# Altium schematic sheet [16]-ETH_SWITCH.SchDoc
size A4
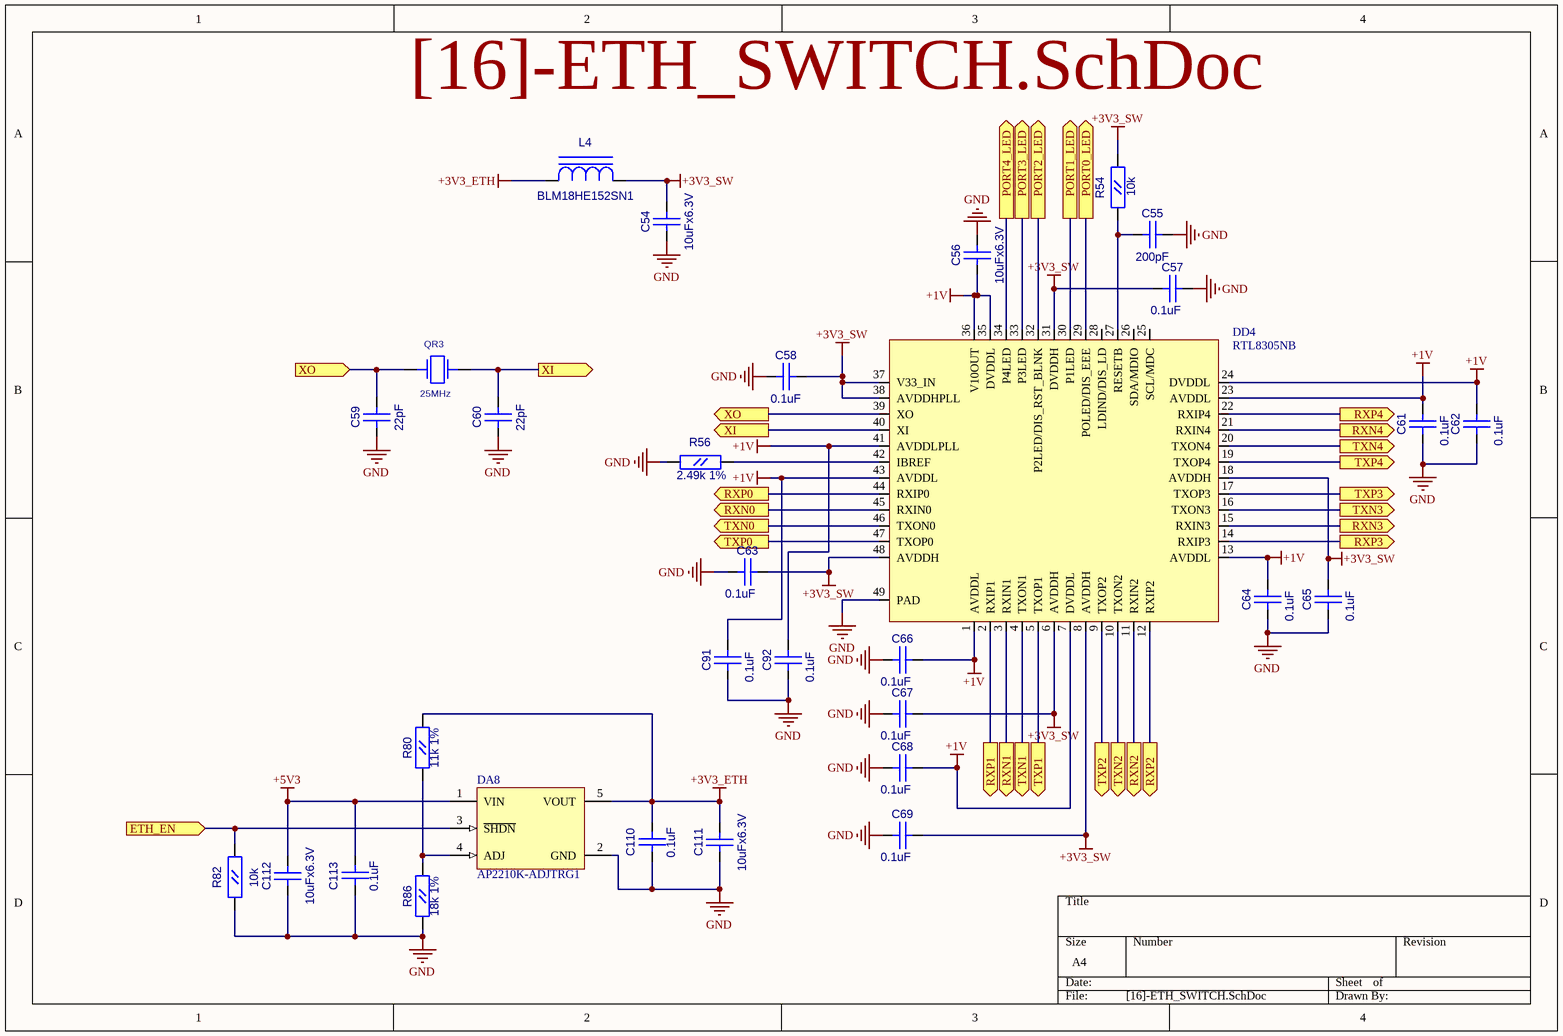
[diagram p0: [16]-ETH_SWITCH.SchDoc]

## Parts
C54  10uFx6.3V  [CC0805]
C55  200pF  [CC0603]
C56  10uFx6.3V  [CC0805]
C57  0.1uF  [CC0603]
C58  0.1uF  [CC0603]
C59  22pF  [CC0603]
C60  22pF  [CC0603]
C61  0.1uF  [CC0603]
C62  0.1uF  [CC0603]
C63  0.1uF  [CC0603]
C64  0.1uF  [CC0603]
C65  0.1uF  [CC0603]
C66  0.1uF  [CC0603]
C67  0.1uF  [CC0603]
C68  0.1uF  [CC0603]
C69  0.1uF  [CC0603]
C91  0.1uF  [CC0603]
C92  0.1uF  [CC0603]
C110  0.1uF  [CC0603]
C111  10uFx6.3V  [CC0805]
C112  10uFx6.3V  [CC0805]
C113  0.1uF  [CC0603]
DA8  AP2210K-ADJTRG1  [SOT23-5]
DD4  RTL8305NB  [QFN48_ISL]
L4  BLM18HE152SN1  [L0603]
QR3  25MHz  [AC5032_2]
R54  10k  [RC0603]
R56  2.49k 1%  [RC0603]
R80  11k 1%  [RC0603]
R82  10k  [RC0603]
R86  18k 1%  [RC0603]

## Ports
ETH_EN (in), PORT0_LED (out), PORT1_LED (out), PORT2_LED (out), PORT3_LED (out), PORT4_LED (out), RXN0 (out), RXN1 (out), RXN2 (out), RXN3 (out), RXN4 (out), RXP0 (out), RXP1 (out), RXP2 (out), RXP3 (out), RXP4 (out), TXN0 (out), TXN1 (out), TXN2 (out), TXN3 (out), TXN4 (out), TXP0 (out), TXP1 (out), TXP2 (out), TXP3 (out), TXP4 (out), XI (out), XO (in), XO (out)

## Nets
+1V: C56.1(A) C61.2(B) C62.2(B) C64.2(B) C66.2(B) C68.2(B) C91.2(B) C92.2(B) DD4.1(AVDDL) DD4.7(DVDDL) DD4.13(AVDDL) DD4.23(AVDDL) DD4.24(DVDDL) DD4.35(DVDDL) DD4.36(V10OUT) DD4.41(AVDDLPLL) DD4.43(AVDDL)
+3V3_ETH: C110.1(A) C111.2(B) DA8.5(VOUT) L4.1(A) R80.2(B)
+3V3_SW: C54.2(B) C57.1(A) C58.2(B) C63.2(B) C65.2(B) C67.2(B) C69.2(B) DD4.6(AVDDH) DD4.8(AVDDH) DD4.18(AVDDH) DD4.31(DVDDH) DD4.37(V33_IN) DD4.38(AVDDHPLL) DD4.48(AVDDH) L4.2(C) R54.2(B)
+5V3: C112.2(B) C113.1(A) DA8.1(VIN)
GND: C54.1(A) C55.2(B) C56.2(B) C57.2(B) C58.1(A) C59.1(A) C60.1(A) C61.1(A) C62.1(A) C63.1(A) C64.1(A) C65.1(A) C66.1(A) C67.1(A) C68.1(A) C69.1(A) C91.1(A) C92.1(A) C110.2(B) C111.1(A) C112.1(A) C113.2(B) DA8.2(GND) DD4.49(PAD) R56.1(A) R82.1(A) R86.1(A)
ETH_EN: DA8.3(~{SHDN}) R82.2(B) ; port ETH_EN
PORT0_LED: DD4.29(POLED/DIS_EEE) ; port PORT0_LED
PORT1_LED: DD4.30(P1LED) ; port PORT1_LED
PORT2_LED: DD4.32(P2LED/DIS_RST_BLNK) ; port PORT2_LED
PORT3_LED: DD4.33(P3LED) ; port PORT3_LED
PORT4_LED: DD4.34(P4LED) ; port PORT4_LED
RXN0: DD4.45(RXIN0) ; port RXN0
RXN1: DD4.3(RXIN1) ; port RXN1
RXN2: DD4.11(RXIN2) ; port RXN2
RXN3: DD4.15(RXIN3) ; port RXN3
RXN4: DD4.21(RXIN4) ; port RXN4
RXP0: DD4.44(RXIP0) ; port RXP0
RXP1: DD4.2(RXIP1) ; port RXP1
RXP2: DD4.12(RXIP2) ; port RXP2
RXP3: DD4.14(RXIP3) ; port RXP3
RXP4: DD4.22(RXIP4) ; port RXP4
TXN0: DD4.46(TXON0) ; port TXN0
TXN1: DD4.4(TXON1) ; port TXN1
TXN2: DD4.10(TXON2) ; port TXN2
TXN3: DD4.16(TXON3) ; port TXN3
TXN4: DD4.20(TXON4) ; port TXN4
TXP0: DD4.47(TXOP0) ; port TXP0
TXP1: DD4.5(TXOP1) ; port TXP1
TXP2: DD4.9(TXOP2) ; port TXP2
TXP3: DD4.17(TXOP3) ; port TXP3
TXP4: DD4.19(TXOP4) ; port TXP4
XI: C60.2(B) DD4.40(XI) QR3.2 ; port XI
XO: C59.2(B) DD4.39(XO) QR3.1 ; port XO
NetC55_1: C55.1(A) DD4.27(RESETB) R54.1(A)
NetDA8_4: DA8.4(ADJ) R80.1(A) R86.2(B)
NetDD4_42: DD4.42(IBREF) R56.2(B)

Not connected (* = marked no-connect by the designer): DD4 25(SCL/MDC) 26(SDA/MDIO) 28(LDIND/DIS_LD)

## Library data of the parts
C54 C56 C111 C112 = CC0805: Value: 10uFx6.3V
C55 C57-C69 C91 C92 C110 C113 = CC0603
  C55: Value: 200pF
  C57 C58 C61-C69 C91 C92 C110 C113: Value: 0.1uF
  C59 C60: Value: 22pF
DA8 = MCP1824T-ADJE/OT: 300 mA, Low Voltage, Low Quiescent Current LDO Regulator, 5-Pin SOT-223, Extended Temperature, Tape and Reel; Published: 29-Jan-2009; DatasheetVersion: revA, Aug-2007; PackageVersion: revAW, Oct-2008; PackageReference: SOT-223-DC5; Publisher: Altium Limited; PackageDescription: 5-Lead Plastic Small Outline Transistor (DC) [SOT-223]; ComponentLink1Description: Manufacturer Link; ComponentLink1URL: http://www.microchip.com; ComponentLink2Description: Datasheet; ComponentLink2URL: http://ww1.microchip.com/downloads/en/DeviceDoc/22070a.pdf; ComponentLink3Description: Packaging Specification; ComponentLink3URL: http://ww1.microchip.com/downloads/en/PackagingSpec/00049AW.pdf
L4 = L0603: Value: BLM18HE152SN1
QR3 = AC5032_2: AC5032/2; Value: 25MHz
R54 R56 R80 R82 R86 = RC0603
  R54 R82: Value: 10k
  R56: Value: 2.49k 1%
  R80: Value: 11k 1%
  R86: Value: 18k 1%
DD4 = RTL8305NB: Value: RTL8305NB